# EAGLE design DexDrip (EAGLE 7.2.0)
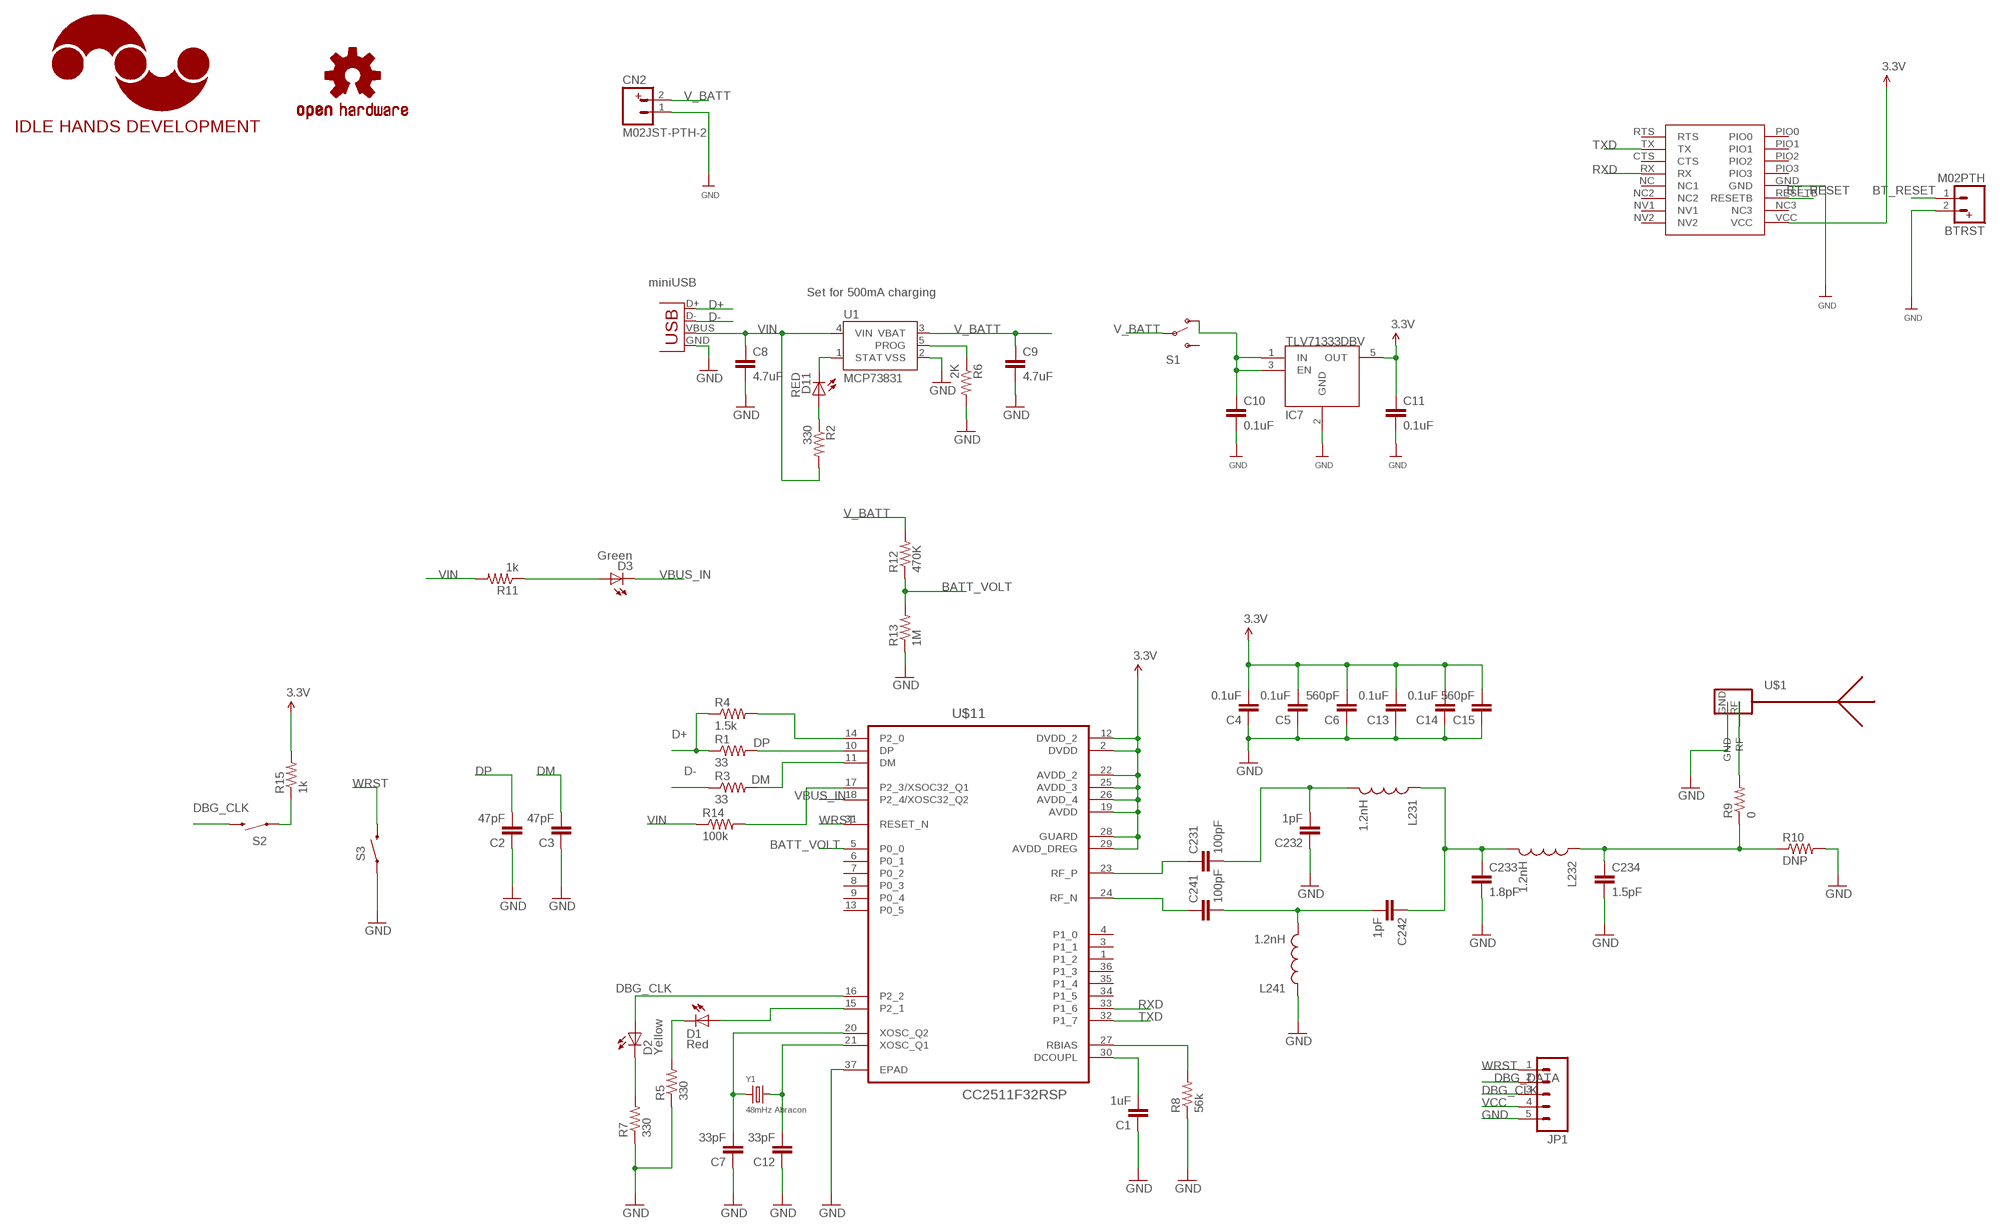
[diagram p0: schematic, sheet 1]

## Parts
BTRST  M02PTH  [1X02]
C1  1uF  .1UF-CER  [0402-CAP]
C2  47pF  .1UF-CER  [0402-CAP]
C3  47pF  .1UF-CER  [0402-CAP]
C4  0.1uF  .1UF-CER  [0402-CAP]
C5  0.1uF  .1UF-CER  [0402-CAP]
C6  560pF  .1UF-CER  [0402-CAP]
C7  33pF  .1UF-CER  [0402-CAP]
C8  4.7uF  CAP0402-CAP  [0402-CAP]
C9  4.7uF  CAP0402-CAP  [0402-CAP]
C10  0.1uF  C-EUC0402  [C0402]
C11  0.1uF  C-EUC0402  [C0402]
C12  33pF  .1UF-CER  [0402-CAP]
C13  0.1uF  .1UF-CER  [0402-CAP]
C14  0.1uF  .1UF-CER  [0402-CAP]
C15  560pF  .1UF-CER  [0402-CAP]
C231  100pF  .1UF-CER  [0402-CAP]
C232  1pF  .1UF-CER  [0402-CAP]
C233  1.8pF  .1UF-CER  [0402-CAP]
C234  1.5pF  .1UF-CER  [0402-CAP]
C241  100pF  .1UF-CER  [0402-CAP]
C242  1pF  .1UF-CER  [0402-CAP]
CN2  M02JST-PTH-2  [JST-2-PTH]
D1  Red  LED0603  [LED-0603]
D2  Yellow  LED0603  [LED-0603]
D3  Green  LED0603  [LED-0603]
D11  RED  LED0603  [LED-0603]
IC7  TLV71333DBV  [SOT-23-5]
JP1  M05LOCK  [1X05_LOCK]
L231  1.2nH  INDUCTOR0402  [C0402]
L232  1.2nH  INDUCTOR0402  [C0402]
L241  1.2nH  INDUCTOR0402  [C0402]
LOGO1  IDLEHANDS_LOGOS  [IHD-LOGO-S]
LOGO2  OSHW-LOGOS  [OSHW-LOGO-S]
R1  33  RESISTOR0402-RES  [0402-RES]
R2  330  RESISTOR0402-RES  [0402-RES]
R3  33  RESISTOR0402-RES  [0402-RES]
R4  1.5k  RESISTOR0402-RES  [0402-RES]
R5  330  RESISTOR0402-RES  [0402-RES]
R6  2K  RESISTOR0402-RES  [0402-RES]
R7  330  RESISTOR0402-RES  [0402-RES]
R8  56k  RESISTOR0402-RES  [0402-RES]
R9  0  RESISTOR0402-RES  [0402-RES]
R10  DNP  RESISTOR0402-RES  [0402-RES]
R11  1k  RESISTOR0402-RES  [0402-RES]
R12  470K  RESISTOR0402-RES  [0402-RES]
R13  1M  RESISTOR0402-RES  [0402-RES]
R14  100k  RESISTOR0402-RES  [0402-RES]
R15  1k  RESISTOR0402-RES  [0402-RES]
S1  SWITCH-SPDT-SMD-A  [SWITCH-SPST-SMD-A]
S2  SWITCH-MOMENTARY-2-SMD-1101NE  [TACTILE-SWITCH-1101NE]
S3  SWITCH-MOMENTARY-2-SMD-1101NE  [TACTILE-SWITCH-1101NE]
U1  MCP73831  [SOT23-5]
U$1  ANTENNA_1LEFT  [SWRA117D_LEFT]
U$2  BT_HM11  [HM11]
U$11  CC2511F32RSP  [QFN50P600X600X90-37N]
X1  Micro USB  USB-MICROB  [USB-MICROB]
Y1  48mHz Abracon  CRYSTAL.3.2X2.5MM  [3.2X2.5MM]

## Nets
BATT_VOLT: R12.1 R13.2 U$11.5(P0_0)
BT_RESET: BTRST.1 U$2.RESETB
D+: R1.1 R4.1 X1.D+
D-: R3.1 X1.D-
DBG_CLK: D2.A JP1.3 S2.P$2 U$11.16(P2_2)
DBG_DATA: D1.A JP1.2 U$11.15(P2_1)
DM: C3.2 R3.2 U$11.11(DM)
DP: C2.2 R1.2 U$11.10(DP)
GND: BTRST.2 C1.1 C2.1 C3.1 C4.1 C5.1 C6.1 C7.1 C8.2 C9.2 C10.2 C11.2 C12.1 C13.1 C14.1 C15.1 C232.1 C233.2 C234.2 CN2.1 IC7.2(GND) JP1.5 L241.1 R5.1 R6.2 R7.1 R8.1 R10.2 R13.1 S3.P$1 U1.2(VSS) U$1.GND U$2.GND U$11.37(EPAD) X1.GND
N$1: R4.2 U$11.14(P2_0)
N$2: D3.A R11.1
N$3: R9.2 U$1.RF
N$4: R8.2 U$11.27(RBIAS)
N$5: C1.2 U$11.30(DCOUPL)
N$6: C10.1 IC7.1(IN) IC7.3(EN) S1.1(O)
N$7: R14.2 U$11.17(P2_3/XSOC32_Q1)
N$8: R15.1 S2.P$1
N$12: D1.C R5.2
N$13: D11.A R2.1
N$14: D2.C R7.2
N$15: C7.2 U$11.20(XOSC_Q2) Y1.1
N$16: C12.2 U$11.21(XOSC_Q1) Y1.3
N$17: C231.1 U$11.23(RF_P)
N$18: C231.2 C232.2 L231.2
N$20: C241.1 U$11.24(RF_N)
N$21: C241.2 C242.2 L241.2
N$22: C233.1 C242.1 L231.1 L232.2
N$24: C234.1 L232.1 R9.1 R10.1
PROG: R6.1 U1.5(PROG)
RXD: U$2.RX U$11.33(P1_6)
STAT: D11.C U1.1(STAT)
TXD: U$2.TX U$11.32(P1_7)
V_BATT: C9.1 CN2.2 R12.2 S1.2(P) U1.3(VBAT)
VBUS_IN: D3.C U$11.18(P2_4/XOSC32_Q2)
VCC: C4.2 C5.2 C6.2 C11.1 C13.2 C14.2 C15.2 IC7.5(OUT) JP1.4 R15.2 U$2.VCC U$11.2(DVDD) U$11.12(DVDD_2) U$11.19(AVDD) U$11.22(AVDD_2) U$11.25(AVDD_3) U$11.26(AVDD_4) U$11.28(GUARD) U$11.29(AVDD_DREG) ; supply symbol labelled 3.3V
VIN: C8.1 R2.2 R11.2 R14.1 U1.4(VIN) X1.VBUS
WRST: JP1.1 S3.P$2 U$11.31(RESET_N)
Unconnected: S1.3(S) U$2.CTS U$2.NC2 U$2.NC3 U$2.NC(NC1) U$2.NV1 U$2.NV2 U$2.PIO0 U$2.PIO1 U$2.PIO2 U$2.PIO3 U$2.RTS U$11.1(P1_2) U$11.3(P1_1) U$11.4(P1_0) U$11.6(P0_1) U$11.7(P0_2) U$11.8(P0_3) U$11.9(P0_4) U$11.13(P0_5) U$11.34(P1_5) U$11.35(P1_4) U$11.36(P1_3)

## Notes on the sheet
- miniUSB
- Set for 500mA charging

## Library data of the parts
BTRST CN2 = SparkFun-Connectors:M02: Standard 2-pin 0.1" header. Use with - straight break away headers ( PRT-00116) - right angle break away headers (PRT-00553) - swiss pins (PRT-00743) - machine pins (PRT-00117) - female headers (PRT-00115) Molex polarized connector foot print use with: PRT-08233 with associated crimp pins and housings. 2.54_SCREWTERM for use with PRT-10571. 3.5mm Screw Terminal footprints for PRT-08084 5mm Screw Terminal footprints for use with PRT-08433
C1-C3 C6 C7 C12 C15 C231-C234 C241 C242 = SparkFun-Capacitors:.1UF-CER: .1uF ceramic SMT CAP-00810- 25V +80%/-20% (0603) CAP-08390- 100V 10% (0603) CAP-08604- 25V 5% (0603); PROD_ID: CAP-00810; VALUE: 0.1uF
C4 C5 C13 C14 = SparkFun-Capacitors:.1UF-CER: .1uF ceramic SMT CAP-00810- 25V +80%/-20% (0603) CAP-08390- 100V 10% (0603) CAP-08604- 25V 5% (0603); PROD_ID: CAP-00810
C8 C9 = SparkFun:CAP: Capacitor Standard 0603 ceramic capacitor, and 0.1" leaded capacitor.
C10 C11 = rcl:C-EU: CAPACITOR, European symbol
D1-D3 D11 = SparkFun:LED: LEDs Standard schematic elements and footprints for 5mm, 3mm, 1206, and 0603 sized LEDs. 5mm - Spark Fun Electronics SKU : COM-00529 (and others)
IC7 = anoven:TLV713: Capacitor-Free, 150-mA, Low-Dropout Regulator with Foldback Current Limit for Portable Devices
JP1 = SparkFun-Connectors:M05: Header 5 Standard 5-pin 0.1" header. Use with straight break away headers (SKU : PRT-00116), right angle break away headers (PRT-00553), swiss pins (PRT-00743), machine pins (PRT-00117), and female headers (PRT-00115). Molex polarized connector foot print use with SKU : PRT-08230 with associated crimp pins and housings.
L231 L232 L241 = SparkFun-Passives:INDUCTOR: Inductors Basic Inductor/Choke - 0603 and 1206. Footprints are not proven and vary greatly between part numbers. SRN6045- 33uH, 20% 1.4A SDR0403-560KL - 56uH, 10%, 500mA RMS/740mA peak
LOGO1 = IdleHandsProject:IDLEHANDS_LOGO: Open Source Hardware Logo This logo indicates the piece of hardware it is found on incorporates a OSHW license and/or adheres to the definition of open source hardware found here: http://freedomdefined.org/OSHW
LOGO2 = SparkFun-Aesthetics:OSHW-LOGO: Open Source Hardware Logo This logo indicates the piece of hardware it is found on incorporates a OSHW license and/or adheres to the definition of open source hardware found here: http://freedomdefined.org/OSHW
R1-R15 = SparkFun:RESISTOR: Resistor Basic schematic elements and footprints for 0603, 1206, and PTH resistors.
S1 = SparkFun-Electromechanical:SWITCH-SPDT: SPDT Switch Simple slide switch, Spark Fun Electronics SKU : COM-00102 DPDT SMT slide switch, AYZ0202, SWCH-08179
S2 S3 = SparkFun-Electromechanical:SWITCH-MOMENTARY-2: Various NO switches- pushbuttons, reed, etc
U1 = SparkFun:MCP73831: Microchip's MCP73831 Miniature single cell, fully integrated Li-Ion, Li-polymer charge management controller http://ww1.microchip.com/downloads/en/DeviceDoc/21984a.pdf
U$1 = ant-planar-1:ANTENNA_1
U$2 = IdleHandsProject:BT_HM11: HM-11 Bluetooth module surface mount. Documentation - Seed Studio <http://www.seeedstudio.com/wiki/Bluetooth_V4.0_HM-11_BLE_Module#Electrical_Characteristics>
U$11 = Texas Instruments_By_element14_Batch_1:CC2511F32RSP
X1 = SparkFun:USB: USB Connectors USB-B-PTH is fully proven SKU : PRT-00139 USB-miniB is fully proven SKU : PRT-00587 USB-A-PCB is untested. USB-A-H is throughly reviewed, but untested. Spark Fun Electronics SKU : PRT-00437 USB-B-SMT is throughly reviewed, but untested. Needs silkscreen touching up. USB-A-S has not been used/tested USB-MB-H has not been used/tested
Y1 = abracon:CRYSTAL

## Board
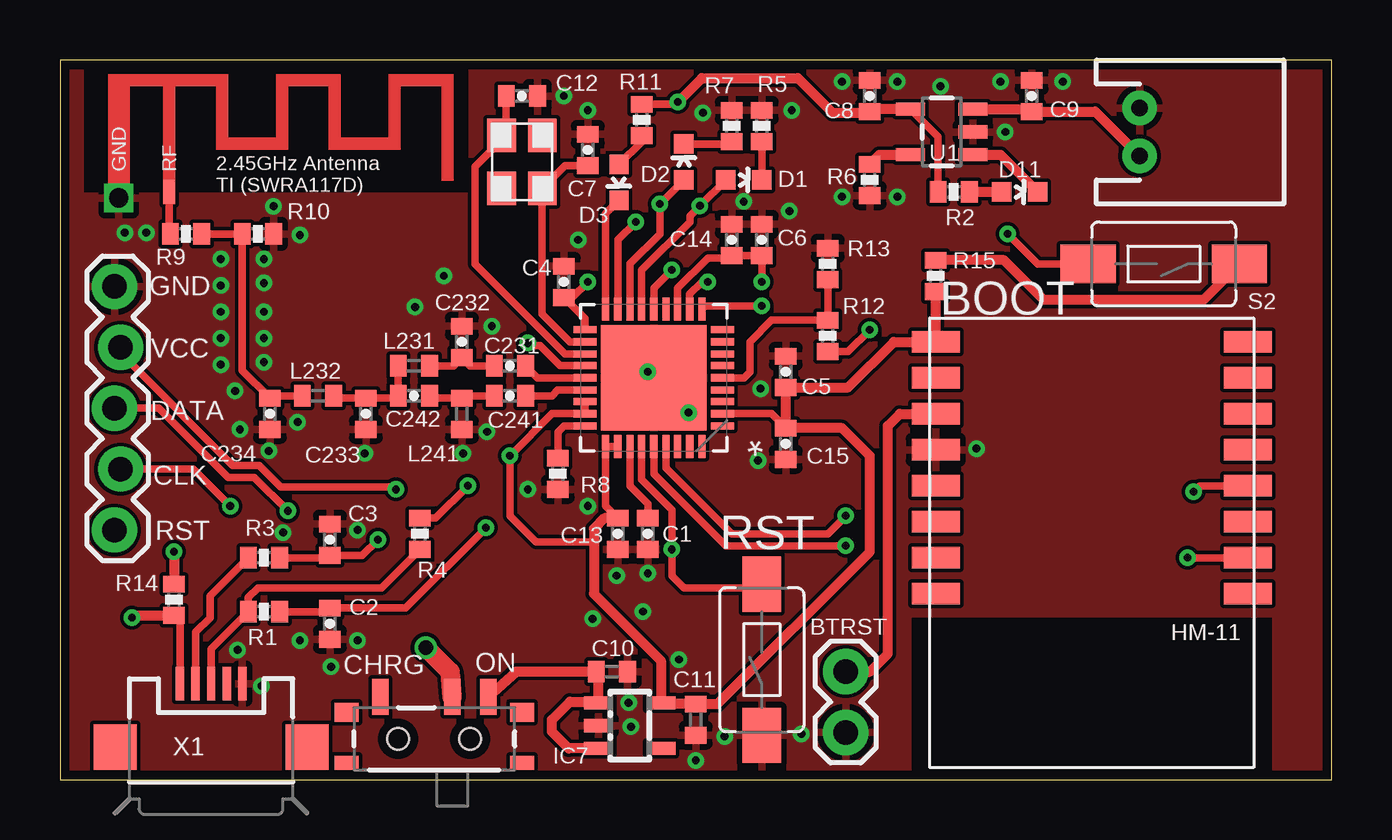
[diagram p1: board, top side]
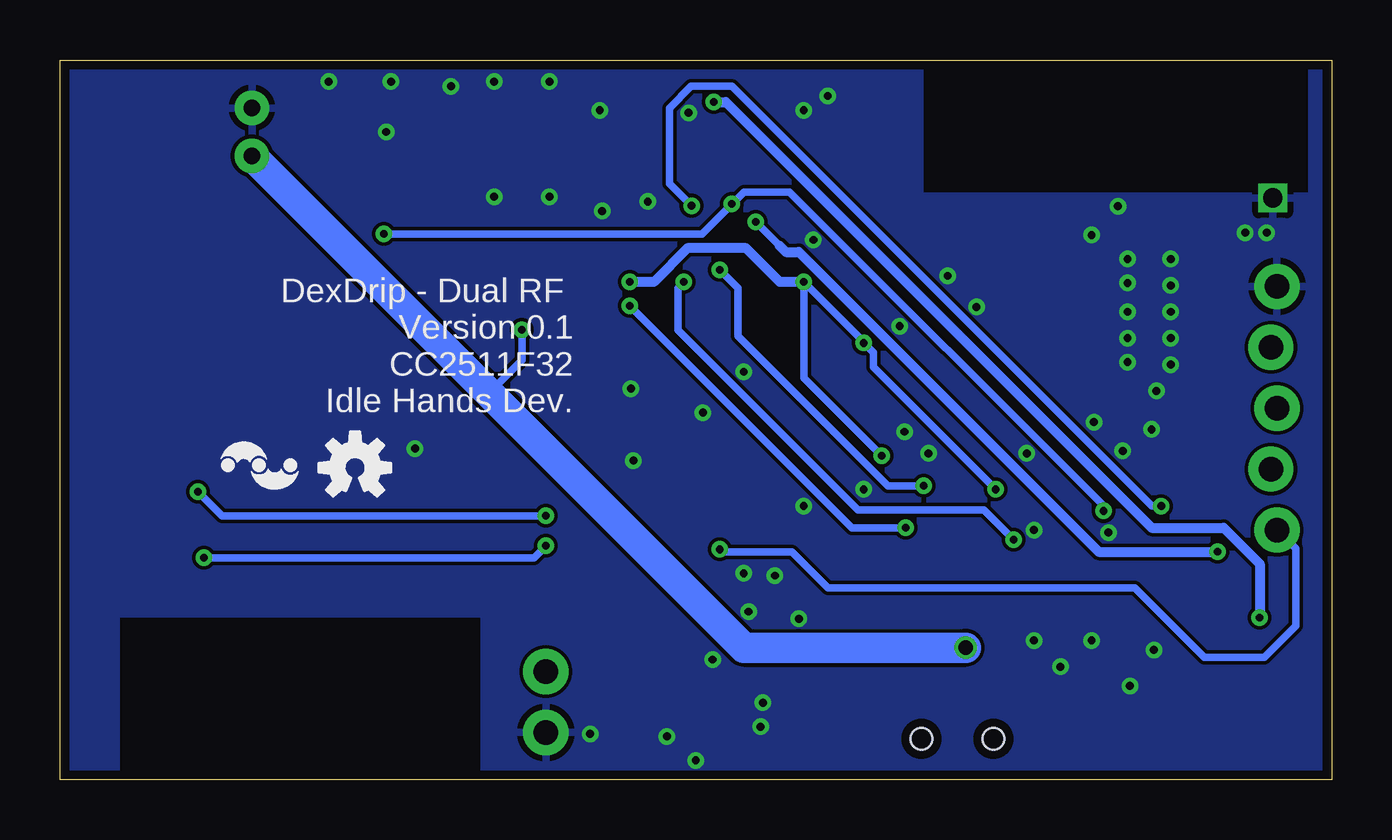
[diagram p2: board, bottom side, seen from below]

Size 53 x 30 mm. Coordinates in mm from the lower left corner, seen from the top.
Outline: 0,0 53,0 53,30 0,30 0,0
Copper layers (1*16): Top 0.0356mm / dielectric 1.5011mm / Bottom 0.0356mm
Design rules "LaenPCBOrder": minimum track width 6mil, minimum drill 13mil, track to track 6mil, track to pad 6mil, pad to pad 6mil, via to via 6mil, smd to smd 6mil, copper to edge 15mil, drill to drill 6mil, minimum pad ring 7mil, minimum via ring 7mil, stop-mask expansion 3mil, vias tented up to drill 0mil, thermal gap 10mil

### Footprints (pad centres in the part's own frame; a part is rotated, then mirrored left to right if it is on the bottom)
1X02 = drill 1.016 pad 1.88: 1 0,0; 2 2.54,0
0402-CAP = smd 0.7 x 0.9: 1 -0.65,0; 2 0.65,0
C0402 = smd 0.7 x 0.9: 1 -0.65,0; 2 0.65,0
JST-2-PTH = drill 0.7 pad 1.448: 1 -1,0; 2 1,0
LED-0603 = smd 0.8 x 0.8: A 0,-0.75; C 0,0.75
SOT-23-5 = smd 0.55 x 1.2: 1 -0.95,-1.3; 2 0,-1.3; 3 0.95,-1.3; 4 0.95,1.3; 5 -0.95,1.3
1X05_LOCK = drill 1.016 pad 1.88: 1 0,0.127; 2 2.54,-0.127; 3 5.08,0.127; 4 7.62,-0.127; 5 10.16,0.127
0402-RES = smd 0.7 x 0.9: 1 -0.65,0; 2 0.65,0
SWITCH-SPST-SMD-A = smd 0.7 x 1.5: 1 -2.25,-1.75; 2 -0.75,-1.75; 3 2.25,-1.75 | smd 1 x 0.6: GND1 -3.65,1; GND3 3.65,1 | smd 1 x 0.8: GND2 -3.65,-1.1; GND4 3.65,-1.1 | hole 0.9: -1.5,0; 1.5,0
TACTILE-SWITCH-1101NE = smd 2.3 x 1.6: P$1 -3.15,0; P$2 3.15,0
SOT23-5 = smd 0.55 x 1.2: 1 -0.95,-1.3; 2 0,-1.3; 3 0.95,-1.3; 4 0.95,1.3; 5 -0.95,1.3
SWRA117D_LEFT = drill 0.8 square: GND 0.45,0.25 | smd 0.508 x 1.016: RF 2.55,0.51
HM11 = smd 2 x 0.9: CTS -6.5,-1; GND 6.5,-4; NC -6.5,-4; NC2 -6.5,-5.5; NC3 6.5,-7; NV1 -6.5,-7; NV2 -6.5,-8.5; PIO0 6.5,2; PIO1 6.5,0.5; PIO2 6.5,-1; PIO3 6.5,-2.5; RESETB 6.5,-5.5; RTS -6.5,2; RX -6.5,-2.5; TX -6.5,0.5; VCC 6.5,-8.5
QFN50P600X600X90-37N = smd 0.965 x 0.305: 1 -2.87,2.007; 2 -2.87,1.499; 3 -2.87,0.991; 4 -2.87,0.508; 5 -2.87,0; 6 -2.87,-0.508; 7 -2.87,-0.991; 8 -2.87,-1.499; 9 -2.87,-2.007; 19 2.87,-2.007; 20 2.87,-1.499; 21 2.87,-0.991; 22 2.87,-0.508; 23 2.87,0; 24 2.87,0.508; 25 2.87,0.991; 26 2.87,1.499; 27 2.87,2.007 | smd 0.305 x 0.965: 10 -2.007,-2.87; 11 -1.499,-2.87; 12 -0.991,-2.87; 13 -0.508,-2.87; 14 0,-2.87; 15 0.508,-2.87; 16 0.991,-2.87; 17 1.499,-2.87; 18 2.007,-2.87; 28 2.007,2.87; 29 1.499,2.87; 30 0.991,2.87; 31 0.508,2.87; 32 0,2.87; 33 -0.508,2.87; 34 -0.991,2.87; 35 -1.499,2.87; 36 -2.007,2.87 | smd 4.394 x 4.394: 37 0,0
USB-MICROB = smd 0.35 x 1.4: D+ 0,2.65; D- -0.65,2.65; GND 1.3,2.65; ID 0.65,2.65; VBUS -1.3,2.65 | smd 1.8 x 1.9: MT1 -4,0; MT2 4,0
3.2X2.5MM = smd 1.4 x 1.2: 1 -1.1,-0.85; 2 1.1,-0.85; 3 1.1,0.85; 4 -1.1,0.85

### Placement (x,y rotation side)
BTRST  32.75,4.5 270 top
C1  24.5,10.25 90 top
C2  11.25,6.5 90 top
C3  11.25,10 270 top
C4  21,20.75 270 top
C5  30.25,17 270 top
C6  29.25,22.5 270 top
C7  22,26.25 270 top
C8  33.75,28.5 90 top
C9  40.5,28.5 90 top
C10  23,4.5 0 top
C11  26.5,2.5 270 top
C12  19.25,28.5 180 top
C13  23.25,10.25 90 top
C14  28,22.5 270 top
C15  30.25,14 90 top
C231  18.75,17.25 180 top
C232  16.75,18.25 270 top
C233  12.75,15.25 270 top
C234  8.75,15.25 270 top
C241  18.75,16 180 top
C242  14.75,16 0 top
CN2  45,27 270 top
D1  28.5,25 270 top
D2  26,25.75 0 top
D3  23.3,24.9 180 top
D11  40,24.5 270 top
IC7  23.75,2.25 270 top
JP1  2.4,10.4 90 top
L231  14.75,17.25 0 top
L232  10.75,16 0 top
L241  16.75,15.25 90 top
LOGO1  44.7,13.1 180 bottom
LOGO2  40.7,13 0 bottom
R1  8.5,7 0 top
R2  37.25,24.5 180 top
R3  8.5,9.25 0 top
R4  15,10.25 90 top
R5  29.25,27.25 270 top
R6  33.75,25 270 top
R7  28,27.25 270 top
R8  20.75,12.75 90 top
R9  5.25,22.75 180 top
R10  8.25,22.75 0 top
R11  24.25,27.5 90 top
R12  32,18.5 270 top
R13  32,21.5 270 top
R14  4.75,7.5 90 top
R15  36.5,21 270 top
S1  15.6,1.7 180 top
S2  46,21.5 180 top
S3  29.25,5 90 top
U1  36.75,27 90 top
U$1  2,24 0 top
U$2  43,9.75 180 top
U$11  24.75,16.75 180 top
X1  6.3,1.35 0 top
Y1  19.25,25.75 90 top

### Tracks (layer width: path | path; a pad name or v marks a point on that pad's centre or on a via)
BATT_VOLT
  Top 0.305: U$11.5 28.5,16.75 28.75,17 28.75,18.25 29.65,19.15 R12.1 R13.2
BT_RESET
  Top 0.406: BTRST.1 33.75,4.5 34.5,5.25 34.5,14.75 35,15.25 U$2.RESETB
D+
  Top 0.305: R4.1 13.4,8 8.25,8 7.85,7.6 R1.1 6.3,5.45 X1.D+
D-
  Top 0.305: R3.1 6.25,7.65 6.25,6.75 5.65,6.15 X1.D-
DBG_CLK  (via drill 0.33)
  Top 0.305: U$11.16 23.76,21.51 25,22.75 v25,24 D2.A | S2.P$2 40.75,21.5 v39.5,22.75 | JP1.3 4.12,15.48 7,12.6 8.1,12.6 v9.5,11.2
  Bottom 0.305: v39.5,22.75 26.25,22.75 v25,24 24.5,24.5 22.6,24.5 9.5,11.4 v9.5,11.2
DBG_DATA  (via drill 0.33)
  Top 0.305: U$11.15 24.24,21.24 26.25,23.25 26.25,23.5 v26.68,23.93 D1.A | JP1.2 5.56,12.94 v7.1,11.4
  Bottom 0.305: v7.1,11.4 7.5,11.4 25,28.9 26.7,28.9 27.6,28 27.6,24.85 v26.68,23.93
DM  (via drill 0.33)
  Top 0.305: R3.2 11.15,9.25 C3.2 12.6,9.35 v13.25,10 | v27,20.75 26.75,20.75 26.25,20.25 U$11.11
  Bottom 0.305: v27,20.75 27.25,20.5 27.25,18.75 19.75,11.25 14.5,11.25 v13.25,10
DP  (via drill 0.33)
  Top 0.305: R1.2 11.1,7 C2.2 14.4,7.15 v17.75,10.5 | v29.25,19.75 26.89,19.75 U$11.10
  Bottom 0.305: v17.75,10.5 20,10.5 v29.25,19.75
GND  (via drill 0.33)
  other vias: 7.5,14.6 8.7,13.7 9.9,14.9 12.7,13.6 10,5.8 11.3,4.7 12.4,5.8 8.4,3.9 7.4,5.4 8.5,21.7 10,22.7 8.9,23.9 21,28.5 22,27.9 21.6,22.5 26.2,15.3 24.5,17 29.1,13.3 30.9,1.9 26.5,0.8 27.7,1.8 29.2,16.3 38.2,13.8 41.8,29.1 39.2,29.1 39.4,27 36.7,28.9 34.9,29.1 34.9,24.3 32.6,24.3 30.5,27.9 26.8,27.8 30.4,23.7 28.5,24.1 18,18.9 16,21 14.8,19.7 17.8,14.5 16.8,13.6 22,11.4 19.5,12.1 23.2,8.5 24.5,8.6 22.2,6.7 25.8,5 24.3,7 23.7,3.2 23.8,2.2 32.6,29.1 12.4,10.4 9.3,10.3 3.6,22.8 2.7,22.8 6.7,21.7 6.7,20.6 6.7,19.5 6.7,18.4 6.7,17.3 7.3,16.2 8.5,17.4 8.5,18.4 8.5,19.5 8.5,20.7
  pour Bottom: 0,0 0,30 53,30 53,0
  pour Top: 0,0 0,30 53,30 53,0
N$1  (via drill 0.33)
  Top 0.305: R4.2 15.65,10.9 v17,12.25 | v25.5,21.25 24.75,20.5 U$11.14
  Bottom 0.305: v17,12.25 18.5,12.25 24.75,18.5 24.75,20.5 v25.5,21.25
N$2
  Top 0.305: R11.1 24.25,26.6 D3.A
N$3
  Top 0.305: R9.2 4.55,22.8 U$1.RF
N$4
  Top 0.305: R8.2 20.75,14.5 21,14.75 U$11.27
N$5
  Top 0.305: U$11.30 23.76,12.24 24.5,11.5 C1.2
N$6
  Top 0.406: IC7.3 21.2,1.3 20.5,2 20.5,2.5 21.25,3.25 22.4,3.25 IC7.1 22.45,4.4 C10.1 19,4.5 S1.1
N$7  (via drill 0.33)
  Top 0.305: U$11.17 23.25,22.5 v24,23.25
  Top 0.406: v4.75,9.5 R14.2
  Bottom 0.305: v24,23.25 23,22.25
  Bottom 0.406: 23,22.25 22.75,22 22.2,22 9.7,9.5 v4.75,9.5
N$8
  Top 0.406: S2.P$1 47.65,20 41,20 39.35,21.65 R15.1
N$12
  Top 0.305: D1.C R5.2
N$13
  Top 0.406: D11.A R2.1
N$14
  Top 0.305: D2.C 27.9,26.5 R7.2
N$15
  Top 0.305: 20,24.55 Y1.1 | Y1.1 21.05,25.6 C7.2 | U$11.20 21.25,18.25 20.1,19.4 Y1.1
N$16
  Top 0.305: C12.2 18.6,27.05 Y1.3 18.4,26.65 17.3,25.55 17.3,21.5 21.06,17.74 U$11.21
N$17
  Top 0.305: C231.1 19.9,16.75 U$11.23
N$18
  Top 0.305: C231.2 17.1,17.25 C232.2 16.4,17.25 L231.2
N$20
  Top 0.305: U$11.24 20.74,16.24 20.5,16 C241.1
N$21
  Top 0.305: C241.2 16.85,16 L241.2 15.5,15.9 C242.2
N$22
  Top 0.305: L231.1 C242.1 14,15.9 C233.1 11.5,15.9 L232.2
N$24
  Top 0.305: L232.1 8.85,16 C234.1 7.6,17.05 R10.1 R9.1
PROG
  Top 0.406: R6.1 34.15,26.05 U1.5
RXD  (via drill 0.33)
  Top 0.305: U$11.33 25.26,12.99 28,10.25 32,10.25 v32.75,11 | v47.25,12 47.5,12.25 U$2.RX
  Bottom 0.305: v32.75,11 46.25,11 v47.25,12
STAT
  Top 0.406: U1.1 39.2,26.05 D11.C
TXD  (via drill 0.33)
  Top 0.305: U$11.32 24.75,12.75 27.75,9.75 v32.75,9.75 | v47,9.25 U$2.TX
  Bottom 0.305: v32.75,9.75 33.25,9.25 v47,9.25
V_BATT  (via drill 0.33, 0.6)
  Top 0.305: R12.2 32.85,17.85 v33.75,18.75
  Top 0.406: U1.3 40.4,27.95 C9.1 43.15,27.85 CN2.2
  Top 0.813: v15.25,5.5 16.25,4.5 S1.2
  Bottom 0.305: v33.75,18.75 33.75,17.5 35.12,16.12
  Bottom 1.27: CN2.2 35.12,16.12 24.5,5.5 v15.25,5.5
VBUS_IN
  Top 0.305: U$11.18 22.74,23.59 D3.C
VCC  (via drill 0.33)
  Top 0.305: C13.2 22.74,11.41 U$11.28 U$11.29 | U$11.25 U$11.26 20.5,15.25 v18.75,13.5 18.75,11 19.85,9.9 22.25,9.9 | C15.2 29.65,15.25 U$11.2 | U$11.19 21.88,19.22 C4.2 21.35,20.1 v22,20.75 | v29.25,20.75 C6.2 C14.2 27.9,21.75 27,21.75 25.74,20.49 U$11.12 | U$11.22 20.84,17.26 20,18.1 19.6,18.1 v19.5,18.2 | v14,12.1 13.9,12.2 9.2,12.2 8.3,13.1 7.2,13.1 2.53,17.77 JP1.4
  Top 0.406: R15.2 U$2.VCC 34.75,18.25 32.85,16.35 C5.2 C15.2 32.6,14.65 33.75,13.5 33.75,9.5 27.4,3.15 C11.1 25.1,3.15 IC7.5 25.05,4.95 22.25,7.75 22.25,9.9 22.25,10.45 22.7,10.9 C13.2
  Bottom 0.305: v18.75,13.5 22,16.75 v22,20.75 19.45,18.2 v19.5,18.2 19.1,17.8 19.1,17.2 v14,12.1
  Bottom 0.406: v22,20.75 23,20.75 24.4,22.15 26.85,22.15 28.25,20.75 v29.25,20.75
VIN  (via drill 0.33)
  Top 0.305: R2.2 36.6,26.8 U1.4 | R11.2 25.65,28.15 v25.75,28.25 | R14.1 5,6.6 X1.VBUS
  Top 0.406: U1.4 33.85,27.95 C8.1 33.7,27.8 32.2,27.8 30.75,29.25 26.75,29.25 v25.75,28.25 | v3,6.75 3.1,6.85 R14.1
  Bottom 0.406: v25.75,28.25 25.25,28.25 7.5,10.5 4.5,10.5 3,9 v3,6.75
WRST  (via drill 0.33)
  Top 0.305: U$11.31 24.24,12.51 25.5,11.25 v25.5,9.6 25.5,8.5 26,8 29.1,8 S3.P$2
  Bottom 0.305: v25.5,9.6 25.4,9.5 22.5,9.5 21,8 8.2,8 5.3,5.1 2.8,5.1 1.5,6.4 1.5,9.63 JP1.1

### Text on the board
tNames: GND | BOOT | VCC | DATA | CLK | RST | RST | HM-11 | ON | CHRG
bNames: DexDrip - Dual RF / Version 0.1 / CC2511F32 / Idle Hands Dev.